# Altium project TFTInstrumentCluster.PrjPCB (part 2 of 2)
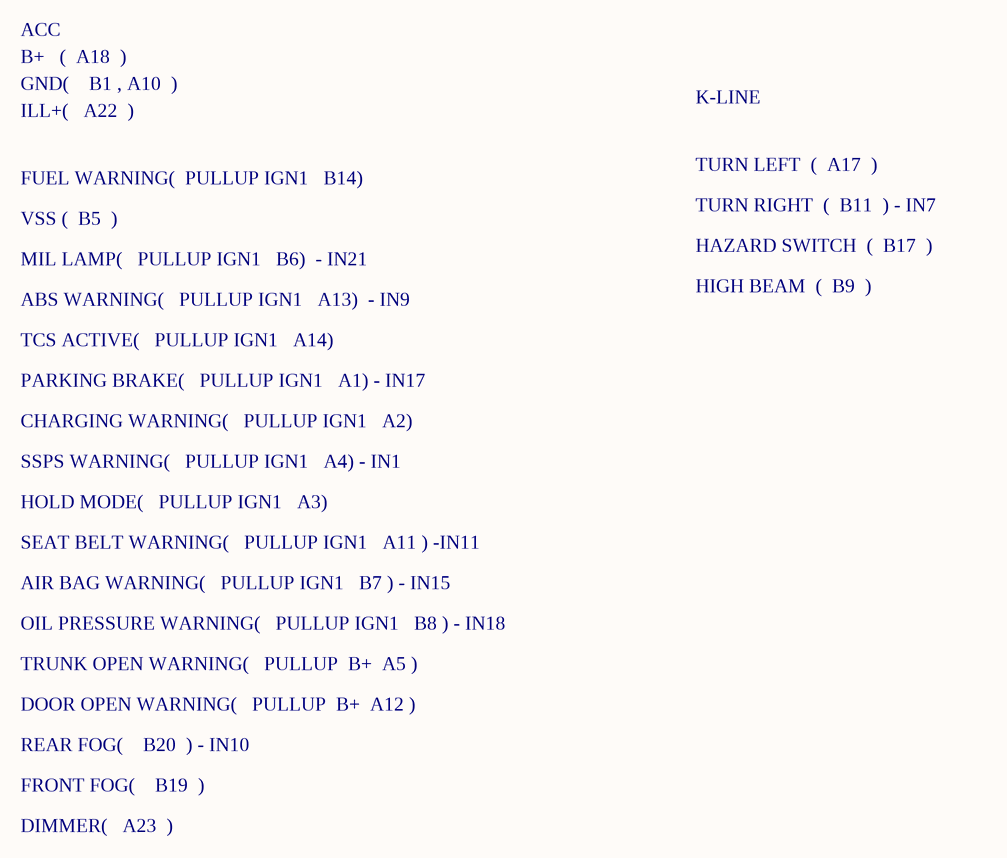
[diagram p11: External Connectors.SchDoc]

## Nets that join several sheets
+3.3V: InstrumentCluster (7 pins), Power (5 pins), Video (6 pins), CPU Board Connectors (P23.9 P23.12), CAN Interface (C36.2 U7.3), KL Link (C37.1 U8.3), RTC (C44.1 U10.8)
+3.3V_STB: Power (C17.2 C18.1 U3.3), MCU (10 pins), RTC (C45.2 U10.3), U_IO/LC1 (R28_LC1.1), U_IO/LC2 (R28_LC2.1), U_IO/LC3 (R28_LC3.1), U_IO/LC4 (R28_LC4.1), U_IO/LC5 (R28_LC5.1), U_IO/LC6 (R28_LC6.1), U_IO/LC7 (R28_LC7.1), U_IO/LC8 (R28_LC8.1), U_IO/LC9 (R28_LC9.1), U_IO/LC10 (R28_LC10.1), U_IO/LC11 (R28_LC11.1), U_IO/LC12 (R28_LC12.1), U_IO/LC13 (R28_LC13.1), U_IO/LC14 (R28_LC14.1), U_IO/LC15 (R28_LC15.1), U_IO/LC16 (R28_LC16.1), U_IO/LC17 (R28_LC17.1), U_IO/LC18 (R28_LC18.1), U_IO/LC19 (R28_LC19.1), U_IO/LC20 (R28_LC20.1), U_IO/LC21 (R28_LC21.1), U_IO/LC22 (R28_LC22.1), U_IO/LC23 (R28_LC23.1)
+5V: Power (5 pins), CPU Board Connectors (10 pins)
+12V_BAT: Power (7 pins), IO (L3.2)
+12V_IN: KL Link (R33.2 U8.7), IO (7 pins)
BKL_PWR: InstrumentCluster (P9.1 P9.2 P9.3), Power (Q1.5 Q1.6 Q1.7 Q1.8)
GND: InstrumentCluster (15 pins), Power (24 pins), Video (31 pins), CPU Board Connectors (21 pins), MCU (15 pins), CAN Interface (C36.1 R30.1 U7.2), KL Link (C37.2 R34.1 U8.5), RTC (C44.2 C45.1 U10.4), IO (20 pins), U_IO/LC1 (R55_LC1.1 U6_LC1.3), U_IO/LC2 (R55_LC2.1 U6_LC2.3), U_IO/LC3 (R55_LC3.1 U6_LC3.3), U_IO/LC4 (R55_LC4.1 U6_LC4.3), U_IO/LC5 (R55_LC5.1 U6_LC5.3), U_IO/LC6 (R55_LC6.1 U6_LC6.3), U_IO/LC7 (R55_LC7.1 U6_LC7.3), U_IO/LC8 (R55_LC8.1 U6_LC8.3), U_IO/LC9 (R55_LC9.1 U6_LC9.3), U_IO/LC10 (R55_LC10.1 U6_LC10.3), U_IO/LC11 (R55_LC11.1 U6_LC11.3), U_IO/LC12 (R55_LC12.1 U6_LC12.3), U_IO/LC13 (R55_LC13.1 U6_LC13.3), U_IO/LC14 (R55_LC14.1 U6_LC14.3), U_IO/LC15 (R55_LC15.1 U6_LC15.3), U_IO/LC16 (R55_LC16.1 U6_LC16.3), U_IO/LC17 (R55_LC17.1 U6_LC17.3), U_IO/LC18 (R55_LC18.1 U6_LC18.3), U_IO/LC19 (R55_LC19.1 U6_LC19.3), U_IO/LC20 (R55_LC20.1 U6_LC20.3), U_IO/LC21 (R55_LC21.1 U6_LC21.3), U_IO/LC22 (R55_LC22.1 U6_LC22.3), U_IO/LC23 (R55_LC23.1 U6_LC23.3)
ACC_OUT: MCU (U9.60), IO (D3.2 R45.1 R46.1)
ADV_RST: Video (U5.51), CPU Board Connectors (P3.34)
CAN1_RX: CPU Board Connectors (P4.36), CAN Interface (U7.4)
CAN1_TX: CPU Board Connectors (P4.35), CAN Interface (U7.1)
CSI0_DAT0: Video (U5.8), CPU Board Connectors (P3.23)
CSI0_DAT1: Video (U5.7), CPU Board Connectors (P3.24)
CSI0_DAT2: Video (U5.6), CPU Board Connectors (P3.25)
CSI0_DAT3: Video (U5.5), CPU Board Connectors (P3.26)
CSI0_DAT4: Video (U5.62), CPU Board Connectors (P3.27)
CSI0_DAT5: Video (U5.61), CPU Board Connectors (P3.28)
CSI0_DAT6: Video (U5.60), CPU Board Connectors (P3.29)
CSI0_DAT7: Video (U5.59), CPU Board Connectors (P3.30)
CSI.LLC: Video (U5.20), CPU Board Connectors (P3.33)
CSI.VH: Video (U5.2), CPU Board Connectors (P3.31)
CSI.VS: Video (U5.64), CPU Board Connectors (P3.32)
GP_ANALOG: MCU (U9.59), IO (D5.2 R51.1 R52.1)
I2C2_SCL: InstrumentCluster (R25.2), Video (U5.54), CPU Board Connectors (P2.36), MCU (U9.25), RTC (U10.6)
I2C2_SDA: InstrumentCluster (R26.2), Video (U5.53), CPU Board Connectors (P2.37), MCU (U9.26), RTC (U10.5)
ILLU_OUT: MCU (U9.61), IO (C43.2 D2.2 R40.1 R42.1)
LVDS0_CLK_N: InstrumentCluster (P7.11), CPU Board Connectors (P3.9)
LVDS0_CLK_P: InstrumentCluster (P7.12), CPU Board Connectors (P3.7)
LVDS0_TX0_N: InstrumentCluster (P7.7), CPU Board Connectors (P3.5)
LVDS0_TX0_P: InstrumentCluster (P7.8), CPU Board Connectors (P3.3)
LVDS0_TX1_N: InstrumentCluster (P7.9), CPU Board Connectors (P3.6)
LVDS0_TX1_P: InstrumentCluster (P7.10), CPU Board Connectors (P3.4)
LVDS0_TX2_N: InstrumentCluster (P7.15), CPU Board Connectors (P3.10)
LVDS0_TX2_P: InstrumentCluster (P7.16), CPU Board Connectors (P3.8)
LVDS0_TX3_N: InstrumentCluster (P7.17), CPU Board Connectors (P3.13)
LVDS0_TX3_P: InstrumentCluster (P7.18), CPU Board Connectors (P3.11)
MISO: MCU (P13.9 U9.3), KL Link (U8.4)
NetP9_6: InstrumentCluster (P9.6), MCU (U9.16)
NetP14_1: IO (P14.1), U_IO/LC1 (R54_LC1.2), U_IO/LC2 (R54_LC2.2), U_IO/LC3 (R54_LC3.2), U_IO/LC4 (R54_LC4.2), U_IO/LC5 (R54_LC5.2), U_IO/LC6 (R54_LC6.2), U_IO/LC7 (R54_LC7.2), U_IO/LC8 (R54_LC8.2), U_IO/LC9 (R54_LC9.2), U_IO/LC10 (R54_LC10.2), U_IO/LC11 (R54_LC11.2), U_IO/LC12 (R54_LC12.2), U_IO/LC13 (R54_LC13.2), U_IO/LC14 (R54_LC14.2), U_IO/LC15 (R54_LC15.2), U_IO/LC16 (R54_LC16.2), U_IO/LC17 (R54_LC17.2), U_IO/LC18 (R54_LC18.2), U_IO/LC19 (R54_LC19.2), U_IO/LC20 (R54_LC20.2), U_IO/LC21 (R54_LC21.2), U_IO/LC22 (R54_LC22.2), U_IO/LC23 (R54_LC23.2)
NetP15_1: CAN Interface (R31.2 U7.7), IO (P15.1)
NetP15_2: CAN Interface (R32.1 U7.6), IO (P15.2)
NetP21_1: KL Link (R33.1 U8.6), IO (P21.1)
NetR7_2: Power (R7.2 U1.6 U2.6), MCU (U9.35)
NetR12_2: Power (R12.2), MCU (U9.39)
NetR24_2: InstrumentCluster (R24.2), Video (U5.29)
NetR27_2: InstrumentCluster (R27.2), MCU (U9.38)
NetR38_2: MCU (R38.2), KL Link (U8.1)
NetR43_2: MCU (U9.32), IO (R43.2)
NetR49_2: MCU (U9.31), IO (R49.2)
NetU1_7: Power (U1.7), MCU (U9.37)
NetU2_7: Power (U2.7), MCU (U9.36)
RESET: InstrumentCluster (Q3.3), CPU Board Connectors (P1.31)
SENSORS_OUT1: MCU (U9.14), U_IO/LC1 (R28_LC1.2 U6_LC1.4)
SENSORS_OUT2: MCU (U9.13), U_IO/LC2 (R28_LC2.2 U6_LC2.4)
SENSORS_OUT3: MCU (U9.12), U_IO/LC3 (R28_LC3.2 U6_LC3.4)
SENSORS_OUT4: MCU (U9.10), U_IO/LC4 (R28_LC4.2 U6_LC4.4)
SENSORS_OUT5: MCU (U9.8), U_IO/LC5 (R28_LC5.2 U6_LC5.4)
SENSORS_OUT6: MCU (U9.7), U_IO/LC6 (R28_LC6.2 U6_LC6.4)
SENSORS_OUT7: MCU (U9.6), U_IO/LC7 (R28_LC7.2 U6_LC7.4)
SENSORS_OUT8: MCU (U9.5), U_IO/LC8 (R28_LC8.2 U6_LC8.4)
SENSORS_OUT9: MCU (U9.4), U_IO/LC9 (R28_LC9.2 U6_LC9.4)
SENSORS_OUT10: MCU (U9.56), U_IO/LC10 (R28_LC10.2 U6_LC10.4)
SENSORS_OUT11: MCU (U9.55), U_IO/LC11 (R28_LC11.2 U6_LC11.4)
SENSORS_OUT12: MCU (U9.54), U_IO/LC12 (R28_LC12.2 U6_LC12.4)
SENSORS_OUT13: MCU (U9.51), U_IO/LC13 (R28_LC13.2 U6_LC13.4)
SENSORS_OUT14: MCU (U9.50), U_IO/LC14 (R28_LC14.2 U6_LC14.4)
SENSORS_OUT15: MCU (U9.49), U_IO/LC15 (R28_LC15.2 U6_LC15.4)
SENSORS_OUT16: MCU (U9.48), U_IO/LC16 (R28_LC16.2 U6_LC16.4)
SENSORS_OUT17: MCU (U9.47), U_IO/LC17 (R28_LC17.2 U6_LC17.4)
SENSORS_OUT18: MCU (U9.46), U_IO/LC18 (R28_LC18.2 U6_LC18.4)
SENSORS_OUT19: MCU (U9.45), U_IO/LC19 (R28_LC19.2 U6_LC19.4)
SENSORS_OUT20: MCU (U9.44), U_IO/LC20 (R28_LC20.2 U6_LC20.4)
SENSORS_OUT21: MCU (U9.42), U_IO/LC21 (R28_LC21.2 U6_LC21.4)
SENSORS_OUT22: MCU (U9.41), U_IO/LC22 (R28_LC22.2 U6_LC22.4)
SENSORS_OUT23: MCU (U9.40), U_IO/LC23 (R28_LC23.2 U6_LC23.4)
UART1_RX: InstrumentCluster (P6.2 R58.1), CPU Board Connectors (P2.35)
UART1_TX: InstrumentCluster (P6.1), CPU Board Connectors (P2.34)
UART2_RX: CPU Board Connectors (P2.31), MCU (U9.28)
UART2_TX: CPU Board Connectors (P2.30), MCU (U9.27)
UART3_RX: InstrumentCluster (P5.2 R59.1), CPU Board Connectors (P2.33)
UART3_TX: InstrumentCluster (P5.1), CPU Board Connectors (P2.32)
VIN: InstrumentCluster (P10.1), Power (Q1.1 Q1.2 Q1.3 R10.2)